# Altium project Micro-NANO.PrjPCB
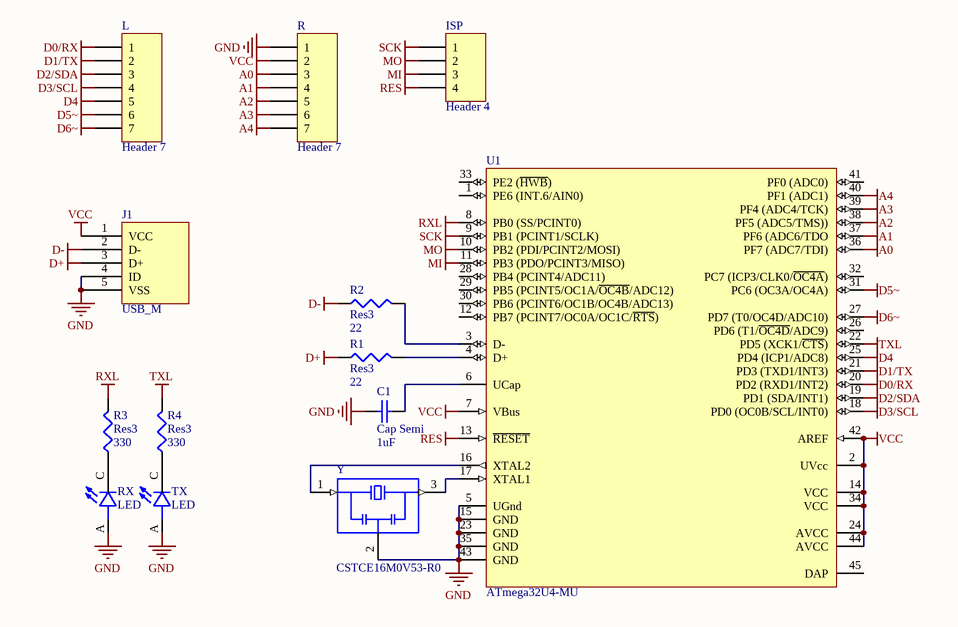
[diagram p0: Sheet.SchDoc]
1 sheet, 13 parts. Net scope: global (net labels, ports and power ports of the same name join across sheets).
Board file: PCB.PcbDoc

## Sheet Sheet.SchDoc
size A4

### Parts
C1  Cap Semi  value 1uF  [1608[0603]]
ISP  Header 4  [HDR1X4]
J1  USB_M  [USB_MICRO]
L  Header 7  [HDR1X7]
R  Header 7  [HDR1X7]
R1  Res3  value 22  [J1-0603]
R2  Res3  value 22  [J1-0603]
R3  Res3  value 330  [J1-0603]
R4  Res3  value 330  [J1-0603]
RX  LED  [LEDC1608X65N]
TX  LED  [LEDC1608X65N]
U1  ATmega32U4-MU  [44PW_N]
Y  CSTCE16M0V53-R0  [OSC_CSTCE16M0V53-R0]

### Nets
A0: R.3 U1.36(PF7_(ADC7/TDI))
A1: R.4 U1.37(PF6_(ADC6/TDO)
A2: R.5 U1.38(PF5_(ADC5/TMS)))
A3: R.6 U1.39(PF4_(ADC4/TCK))
A4: R.7 U1.40(PF1_(ADC1))
D0/RX: L.1 U1.20(PD2_(RXD1/INT2))
D1/TX: L.2 U1.21(PD3_(TXD1/INT3))
D2/SDA: L.3 U1.19(PD1_(SDA/INT1))
D3/SCL: L.4 U1.18(PD0_(OC0B/SCL/INT0))
D4: L.5 U1.25(PD4_(ICP1/ADC8))
D5~: L.6 U1.31(PC6_(OC3A/OC4A))
D6~: L.7 U1.27(PD7_(T0/OC4D/ADC10))
D+: J1.3(D+) R1.1
D-: J1.2(D-) R2.1
GND: C1.1 J1.4(ID) J1.5(VSS) R.1 RX.A TX.A U1.5(UGnd) U1.15(GND) U1.23(GND) U1.35(GND) U1.43(GND) Y.2(GND)
MI: ISP.3 U1.11(PB3_(PDO/PCINT3/MISO))
MO: ISP.2 U1.10(PB2_(PDI/PCINT2/MOSI))
RES: ISP.4 U1.13(~{RESET})
RXL: R3.2 U1.8(PB0_(SS/PCINT0))
SCK: ISP.1 U1.9(PB1_(PCINT1/SCLK))
TXL: R4.2 U1.22(PD5_(XCK1/~{CTS}))
VCC: J1.1(VCC) R.2 U1.2(UVcc) U1.7(VBus) U1.14(VCC) U1.24(AVCC) U1.34(VCC) U1.42(AREF) U1.44(AVCC)
NetC1_2: C1.2 U1.6(UCap)
NetR1_2: R1.2 U1.4(D+)
NetR2_2: R2.2 U1.3(D-)
NetR3_1: R3.1 RX.C
NetR4_1: R4.1 TX.C
NetU1_16: U1.16(XTAL2) Y.1(IN)
NetU1_17: U1.17(XTAL1) Y.3(OUT)

Not connected (* = marked no-connect by the designer): U1 1(PE6_(INT.6/AIN0)) 12(PB7_(PCINT7/OC0A/OC1C/~{RTS})) 26(PD6_(T1/~{OC4D}/ADC9)) 28(PB4_(PCINT4/ADC11)) 29(PB5_(PCINT5/OC1A/~{OC4B}/ADC12)) 30(PB6_(PCINT6/OC1B/OC4B/ADC13)) 32(PC7_(ICP3/CLK0/~{OC4A})) 33(PE2_(~{HWB})) 41(PF0_(ADC0)) 45(DAP)

### Library data of the parts
C1 = Cap Semi: Capacitor (Semiconductor SIM Model); Published: 8-Jun-2000; LatestRevisionDate: 29-May-2009; LatestRevisionNote: IPC-7351 Footprint Added.; PackageReference: C1206; Publisher: Altium Limited; PackageDescription: Chip Capacitor
ISP = Header 4: Header, 4-Pin; LatestRevisionDate: 17-Jul-2002; LatestRevisionNote: Re-released for DXP Platform.; Publisher: Altium Limited
J1 = USB_M: MicroUSB諉諳
L R = Header 7: Header, 7-Pin; LatestRevisionDate: 17-Jul-2002; LatestRevisionNote: Re-released for DXP Platform.; Publisher: Altium Limited
R1-R4 = Res3: Resistor; Published: 8-Jun-2000; LatestRevisionDate: 29-May-2009; LatestRevisionNote: IPC-7351 Footprint Added.; PackageReference: J1-0603; Publisher: Altium Limited; PackageDescription: Chip Resistor
RX TX = LTW-C191TLA: White LED Indication - Discrete 3.1V 0603 _1608 Metric_; MF: Lite-On; MP: LTW-C191TLA; Package: 0603 Lite-On; SnapEDA_Link: https://www.snapeda.com/parts/LTW-C191TLA/Lite-On/view-part/538855/?ref=snap; Availability: Unavailable; Price: None; Value: *
U1 = ATmega32U4-MU: 8-bit AVR Microcontroller, 2.7-5.5V, 32KB Flash, 2.5KB EEPROM, 1KB SRAM, USB Controller, 44-pin QFN, Industrial Grade (-40蚓 to 85蚓); Published: 1-Apr-2010; DatasheetVersion: revD, Jan-2009; PackageVersion: revF, Jul-2007; PackageReference: 44PW; Publisher: Altium Limited; PackageDescription: 44-Pin Quad Flat No-Lead Package, 7 x 7 mm Body, 0.5 mm Pitch (QFN); Supplier 1: Digi-Key; Supplier Part Number 1: ATMEGA32U4-MU-ND; Supplier 2: Mouser; Supplier Part Number 2: 556-ATMEGA32U4-MU; Code_JEDEC: MO-220-VKKD-1; ComponentLink1Description: Manufacturer Link; ComponentLink1URL: http://www.atmel.com/products/avr/default.asp?; ComponentLink2Description: ATmega16U4/32U4 Datasheet; ComponentLink2URL: http://www.atmel.com/dyn/resources/prod_documents/doc7766.pdf; ComponentLink3Description: ATmega16U4 ATmega32U4 Summary; ComponentLink3URL: http://www.atmel.com/dyn/resources/prod_documents/7766S.pdf; ComponentLink4Description: Atmel.com Home; ComponentLink4URL: http://www.atmel.com
Y = CSTCE16M0V53-R0: 16MHz Ceramic Resonator Built in Capacitor 15pF Â±0.3% -20Â°C ~ 80Â°C Surface Mount; MF: Murata; Price: None; Value: *; Availability: Unavailable; SnapEDA_Link: https://www.snapeda.com/parts/CSTCE16M0V53-R0/Murata%20Electronics%20North%20America/view-part/47416/?ref=snap; MP: CSTCE16M0V53-R0; Package: SMD-3 Murata